# Altium project EEM_FMC_Carrier.PrjPCB (part 3 of 9)

## Sheet CLK_Distribution.SchDoc: EEM FMC Carrier
size 420 x 297 mm; EDA_Number: ARTIQ; Projet: ARTIQ/Sinara; CheckedBy: -; CompanyName: WUT ISE; DrawnBy: Paweł Kulik; Organization: WUT ISE; Address1: Warsaw University of Technology; Address2: Nowowiejska 15/19 00-665 Warsaw; Address3: pawel.kulik@pw.edu.pl; DocumentNumber: 5; SheetNumber: 8; SheetTotal: 13; ModifiedBy: -; CheckedDate: -; Title2: Clock distribution; DivGrp: ISE; Designer: Paweł Kulik; ModifiedDate: -; ProjectName: EEM_FMC_Carrier.PrjPCB
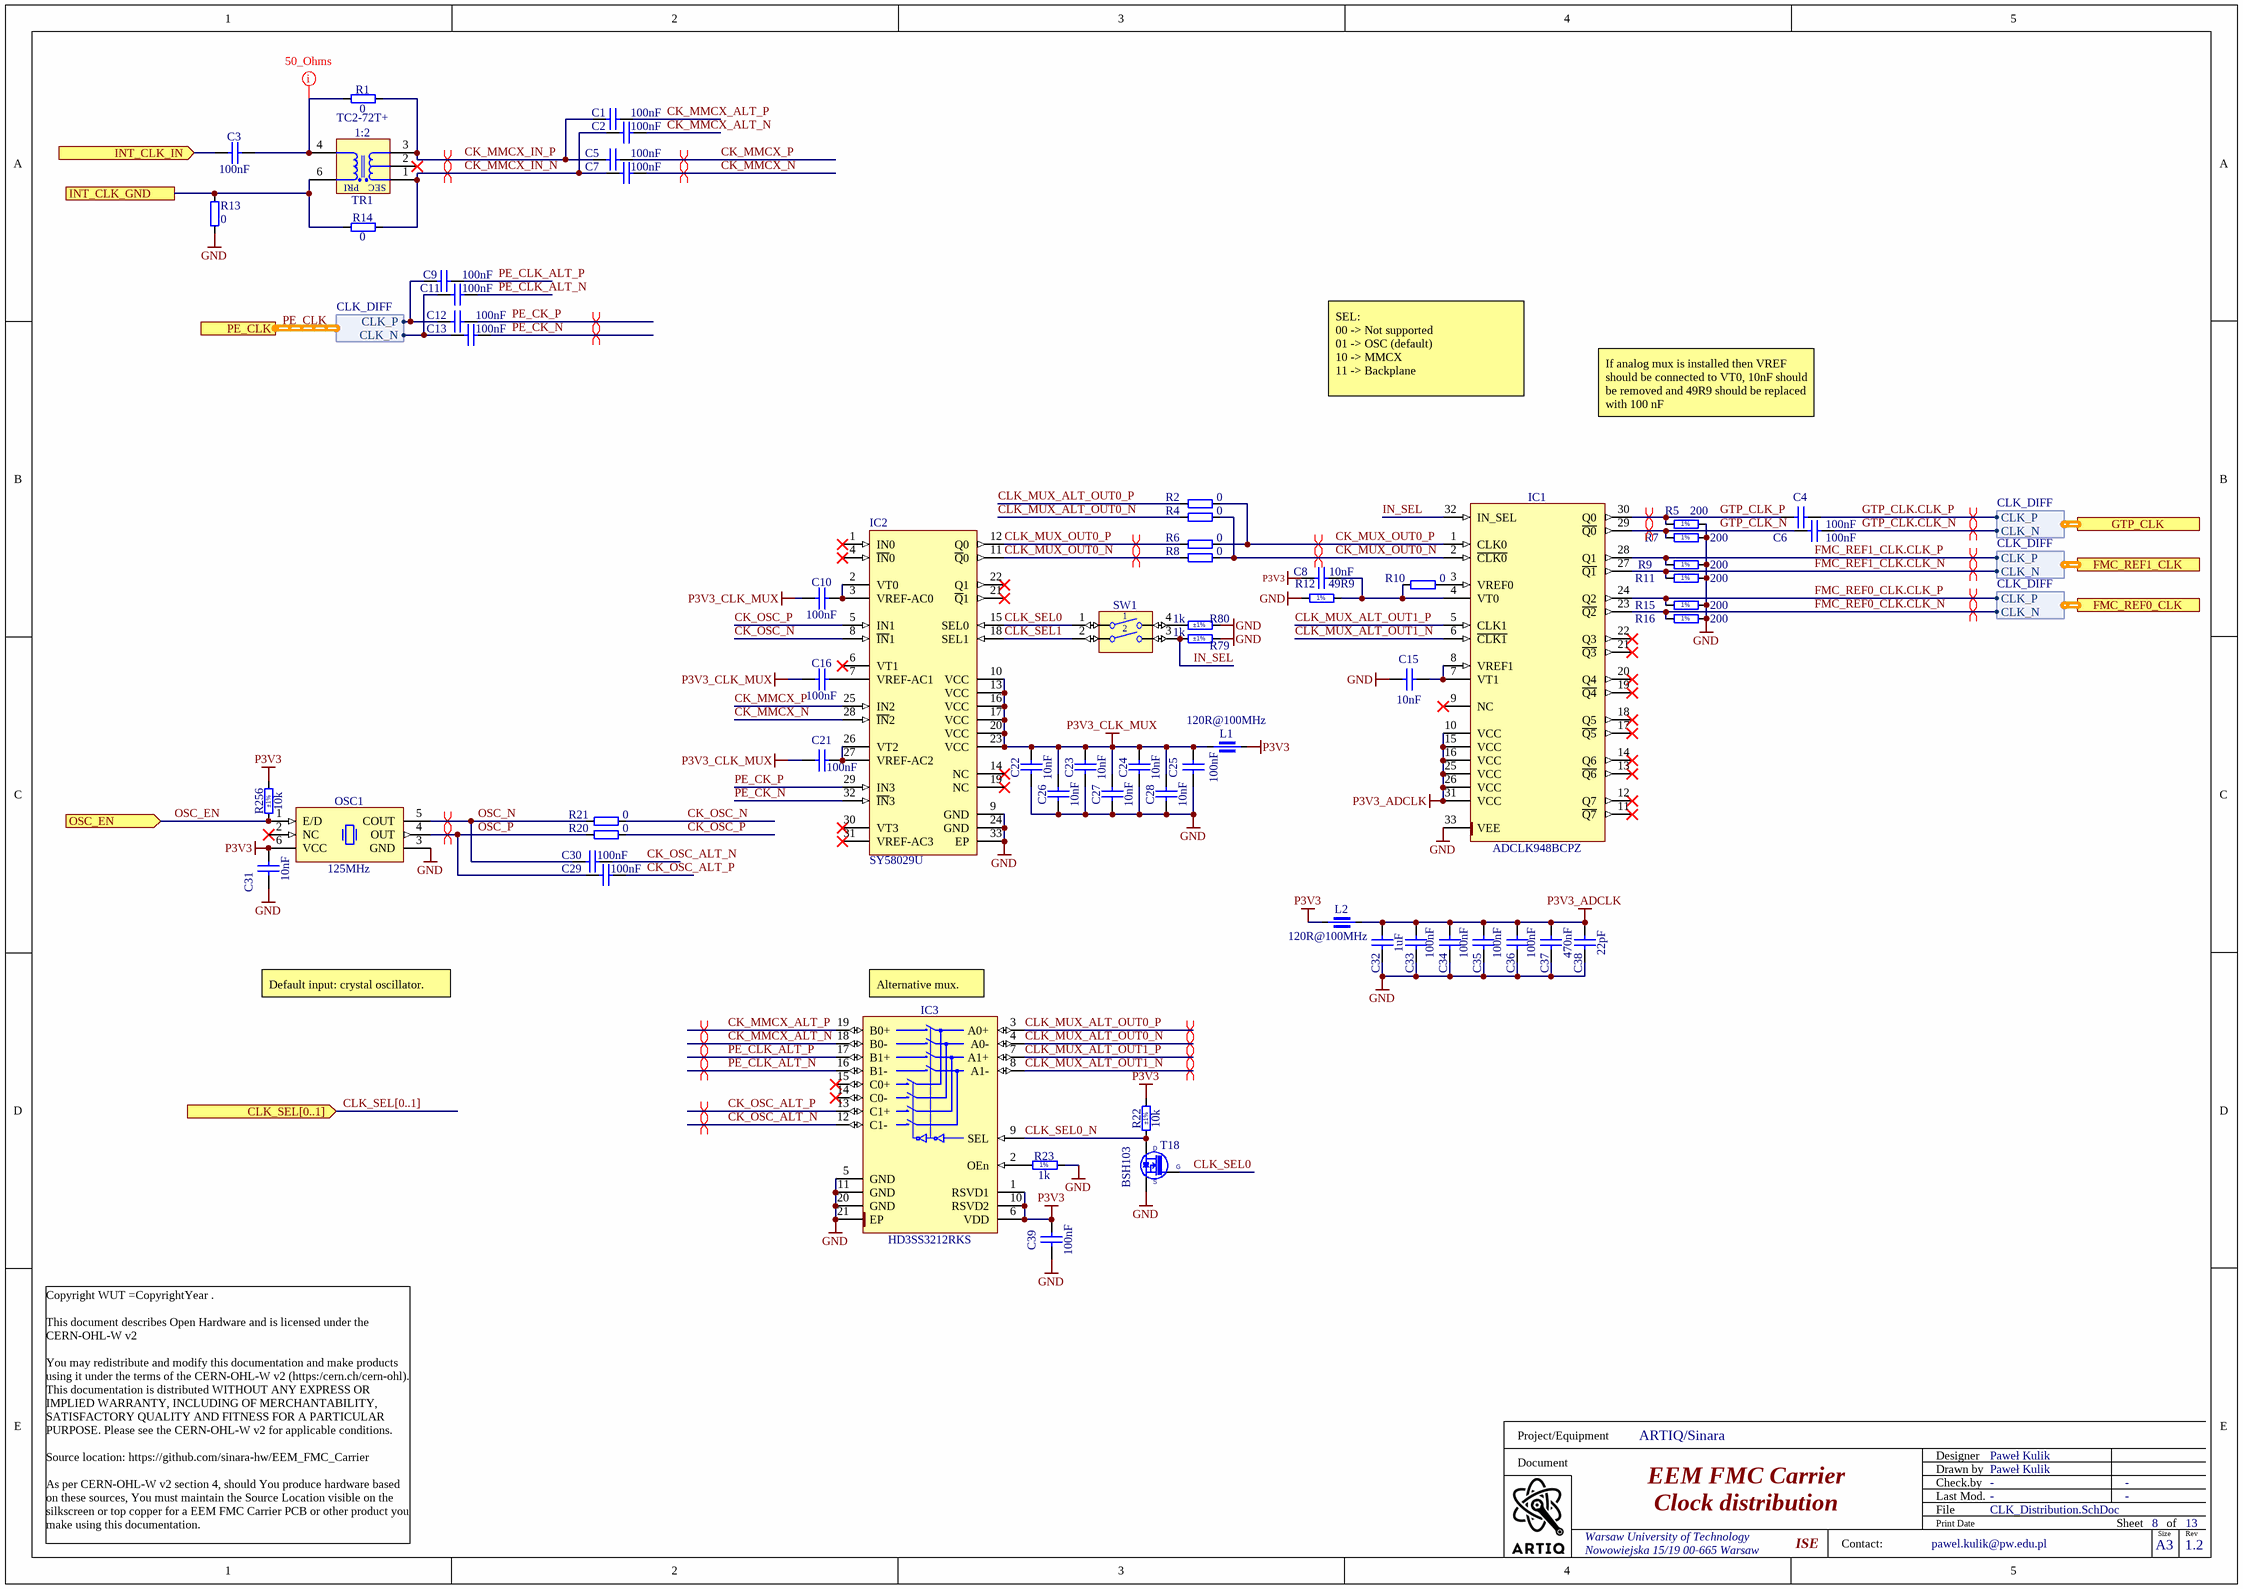
[diagram p3: CLK_Distribution.SchDoc]

### Parts
C1  100nF  [CAPC1005X55N]
C2  100nF  [CAPC1005X55N]
C3  100nF  [CAPC1005X55N]
C4  100nF  [CAPC1005X55N]
C5  100nF  [CAPC1005X55N]
C6  100nF  [CAPC1005X55N]
C7  100nF  [CAPC1005X55N]
C8  10nF  [CAPC1005X55N]
C9  100nF  [CAPC1005X55N]
C10  100nF  [CAPC1005X55N]
C11  100nF  [CAPC1005X55N]
C12  100nF  [CAPC1005X55N]
C13  100nF  [CAPC1005X55N]
C15  10nF  [CAPC1005X55N]
C16  100nF  [CAPC1005X55N]
C21  100nF  [CAPC1005X55N]
C22  10nF  [CAPC1005X55N]
C23  10nF  [CAPC1005X55N]
C24  10nF  [CAPC1005X55N]
C25  100nF  [CAPC1005X55N]
C26  10nF  [CAPC1005X55N]
C27  10nF  [CAPC1005X55N]
C28  10nF  [CAPC1005X55N]
C29  100nF  [CAPC1005X55N]
C30  100nF  [CAPC1005X55N]
C31  10nF  [CAPC1005X55N]
C32  1uF  [CAPC1005X55N]
C33  100nF  [CAPC0603X33N]
C34  100nF  [CAPC0603X33N]
C35  100nF  [CAPC0603X33N]
C36  100nF  [CAPC0603X33N]
C37  470nF  [CAPC0603X33N]
C38  22pF  [CAPC1005X55N]
C39  100nF  [CAPC1005X55N]
IC1  ADCLK948BCPZ  [QFN50P500X500X80-33N-S285]
IC2  SY58029U  [MLF-32]
IC3  HD3SS3212RKS  [TEXAS_RKS0020A]
L1  120R@100MHz  [INDC1608X65N]
L2  120R@100MHz  [INDC1608X65N]
OSC1  125MHz  [OSC_CRYSTEK_CCLD-033]
R1  0  [RESC1005X40N]
R2  0  [RESC0603X28N]
R4  0  [RESC0603X28N]
R5  200  [RESC1005X40N]
R6  0  [RESC0603X28N]
R7  200  [RESC1005X40N]
R8  0  [RESC0603X28N]
R9  200  [RESC1005X40N]
R10  0  [RESC0603X28N]
R11  200  [RESC1005X40N]
R12  49R9  [RESC1005X40N]
R13  0  [RESC1005X40N]
R14  0  [RESC1005X40N]
R15  200  [RESC1005X40N]
R16  200  [RESC1005X40N]
R20  0  [RESC1005X40N]
R21  0  [RESC1005X40N]
R22  10k  Tolerance: ±1%  [RESC1005X40N]
R23  1k  [RESC1005X40N]
R79  1k  Tolerance: ±1%  [RESC1005X40N]
R80  1k  Tolerance: ±1%  [RESC1005X40N]
R256  10k  Tolerance: ±1%  [RESC1005X40N]
SW1  Switch  [SW_TYCO_1571983-1]  (value not drawn)
T18  BSH103  [SOT95P230X110-3N]
TR1  1:2  Manufacturer Part Number: TC2-72T+  [XFMR_MINI-CIRCUITS_AT1521]

### Ports
CLK_SEL[0..1] (in), FMC_REF0_CLK (harness CLK_DIFF), FMC_REF1_CLK (harness CLK_DIFF), GTP_CLK (harness CLK_DIFF), INT_CLK_GND, INT_CLK_IN (in), OSC_EN (in), PE_CLK (harness CLK_DIFF)

### Harnesses
CLK_DIFF: CLK_P, CLK_N
CLK_DIFF: CLK_N, CLK_P

### Nets
GND: C15.1 C22.1 C23.1 C24.1 C25.1 C26.1 C27.1 C28.1 C31.1 C32.1 C33.1 C34.1 C35.1 C36.1 C37.1 C38.1 C39.1 IC1.33(VEE) IC2.9(GND) IC2.24(GND) IC2.33(EP) IC3.5(GND) IC3.11(GND) IC3.20(GND) IC3.21(EP) OSC1.3(GND) R5.2 R7.2 R9.2 R11.2 R12.1 R13.1 R15.2 R16.2 R23.2 R79.2 R80.2 T18.2(S)
P3V3: C8.1 C31.2 C39.2 IC3.1(RSVD1) IC3.6(VDD) IC3.10(RSVD2) L1.1 L2.2 OSC1.6(VCC) R22.2 R256.2
P3V3_ADCLK: C32.2 C33.2 C34.2 C35.2 C36.2 C37.2 C38.2 IC1.10(VCC) IC1.15(VCC) IC1.16(VCC) IC1.25(VCC) IC1.26(VCC) IC1.31(VCC) L2.1
P3V3_CLK_MUX: C10.1 C16.1 C21.1 C22.2 C23.2 C24.2 C25.2 C26.2 C27.2 C28.2 IC2.10(VCC) IC2.13(VCC) IC2.16(VCC) IC2.17(VCC) IC2.20(VCC) IC2.23(VCC) L1.2
CK_MMCX_ALT_N: C2.2 IC3.18(B0-)
CK_MMCX_ALT_P: C1.2 IC3.19(B0+)
CK_MMCX_IN_N: C2.1 C7.1 R14.2 TR1.1(SDOT)
CK_MMCX_IN_P: C1.1 C5.1 R1.2 TR1.3(S)
CK_MMCX_N: C7.2 IC2.28(~{IN}2)
CK_MMCX_P: C5.2 IC2.25(IN2)
CK_MUX_OUT0_N: IC1.2(~{CLK0}) R4.2 R8.2
CK_MUX_OUT0_P: IC1.1(CLK0) R2.2 R6.2
CK_OSC_ALT_N: C30.2 IC3.12(C1-)
CK_OSC_ALT_P: C29.2 IC3.13(C1+)
CK_OSC_N: IC2.8(~{IN}1) R21.2
CK_OSC_P: IC2.5(IN1) R20.2
CLK_MUX_ALT_OUT0_N: IC3.4(A0-) R4.1
CLK_MUX_ALT_OUT0_P: IC3.3(A0+) R2.1
CLK_MUX_ALT_OUT1_N: IC1.6(~{CLK1}) IC3.8(A1-)
CLK_MUX_ALT_OUT1_P: IC1.5(CLK1) IC3.7(A1+)
CLK_MUX_OUT0_N: IC2.11(~{Q}0) R8.1
CLK_MUX_OUT0_P: IC2.12(Q0) R6.1
CLK_SEL0: IC2.15(SEL0) SW1.1 T18.1(G)
CLK_SEL0_N: IC3.9(SEL) R22.1 T18.3(D)
CLK_SEL1: IC2.18(SEL1) SW1.2
FMC_REF0_CLK.CLK_N: IC1.23(~{Q2}) R16.1 ; port FMC_REF0_CLK.CLK_N
FMC_REF0_CLK.CLK_P: IC1.24(Q2) R15.1 ; port FMC_REF0_CLK.CLK_P
FMC_REF1_CLK.CLK_N: IC1.27(~{Q1}) R11.1 ; port FMC_REF1_CLK.CLK_N
FMC_REF1_CLK.CLK_P: IC1.28(Q1) R9.1 ; port FMC_REF1_CLK.CLK_P
GTP_CLK.CLK_N: C6.2 ; port GTP_CLK.CLK_N
GTP_CLK.CLK_P: C4.2 ; port GTP_CLK.CLK_P
GTP_CLK_N: C6.1 IC1.29(~{Q0}) R7.1
GTP_CLK_P: C4.1 IC1.30(Q0) R5.1
IN_SEL: IC1.32(IN_SEL) R79.1 SW1.3
OSC_EN: OSC1.1(E/D) R256.1 ; port OSC_EN
OSC_N: C30.1 OSC1.5(COUT) R21.1
OSC_P: C29.1 OSC1.4(OUT) R20.1
PE_CK_N: C13.2 IC2.32(~{IN}3)
PE_CK_P: C12.2 IC2.29(IN3)
PE_CLK.CLK_N: C11.1 C13.1 ; port PE_CLK.CLK_N
PE_CLK.CLK_P: C9.1 C12.1 ; port PE_CLK.CLK_P
PE_CLK_ALT_N: C11.2 IC3.16(B1-)
PE_CLK_ALT_P: C9.2 IC3.17(B1+)
NetC3_1: C3.1 ; port INT_CLK_IN
NetC3_2: C3.2 R1.1 TR1.4(P)
NetC8_2: C8.2 IC1.4(VT0) R10.1 R12.2
NetC10_2: C10.2 IC2.2(VT0) IC2.3(VREF-AC0)
NetC15_2: C15.2 IC1.7(VT1) IC1.8(VREF1)
NetC16_2: C16.2 IC2.7(VREF-AC1)
NetC21_2: C21.2 IC2.26(VT2) IC2.27(VREF-AC2)
NetIC1_3: IC1.3(VREF0) R10.2
NetIC3_2: IC3.2(OEn) R23.1
NetJ4_2: R13.2 R14.1 TR1.6(PDOT) ; port INT_CLK_GND
NetR80_1: R80.1 SW1.4

Not connected (* = marked no-connect by the designer): IC1 9(NC)* 11(~{Q7})* 12(Q7)* 13(~{Q6})* 14(Q6)* 17(~{Q5})* 18(Q5)* 19(~{Q4})* 20(Q4)* 21(~{Q3})* 22(Q3)*; IC2 1(IN0)* 4(~{IN}0)* 6(VT1)* 14(NC)* 19(NC)* 21(~{Q}1)* 22(Q1)* 30(VT3)* 31(VREF-AC3)*; IC3 14(C0-)* 15(C0+)*; OSC1 2(NC)*; TR1 2(NC)*

### Buses and harness runs
bus CLK_SEL[0..1] = port CLK_SEL[0..1]
harness PE_CLK = port PE_CLK

### Layout directives
differential pair; differential pair class Diff_100Ohm: CK_MMCX_ALT_N, CK_MMCX_ALT_P, CK_MMCX_IN_N, CK_MMCX_IN_P, CK_MMCX_N, CK_MMCX_P, CK_OSC_ALT_N, CK_OSC_ALT_P, OSC_N, OSC_P, PE_CK_N, PE_CK_P, PE_CLK_ALT_N, PE_CLK_ALT_P
net class 50Ohm: NetC3_2
differential pair; differential pair class LVPECL: CK_MUX_OUT0_N, CK_MUX_OUT0_P, CLK_MUX_ALT_OUT0_N, CLK_MUX_ALT_OUT0_P, CLK_MUX_ALT_OUT1_N, CLK_MUX_ALT_OUT1_P, CLK_MUX_OUT0_N, CLK_MUX_OUT0_P, FMC_REF0_CLK.CLK_N, FMC_REF0_CLK.CLK_P, FMC_REF1_CLK.CLK_N, FMC_REF1_CLK.CLK_P, GTP_CLK.CLK_N, GTP_CLK.CLK_P, GTP_CLK_N, GTP_CLK_P

### Notes on the sheet
- SEL:
  00 -> Not supported
  01 -> OSC (default)
  10 -> MMCX
  11 -> Backplane
- If analog mux is installed then VREF should be connected to VT0, 10nF should be removed and 49R9 should be replaced with 100 nF
- Default input: crystal oscillator.
- (near IC3) Alternative mux.
- Project/Equipment
- Document
- Designer
- Drawn by
- Check.by
- Copyright WUT =CopyrightYear .
  This document describes Open Hardware and is licensed under the CERN-OHL-W v2
  You may redistribute and modify this documentation and make products using it under the terms of the CERN-OHL-W v2 (https:/cern.ch/cern-ohl). This documentation is distributed WITHOUT ANY EXPRESS OR IMPLIED WARRANTY, INCLUDING OF MERCHANTABILITY, SATISFACTORY QUALITY AND FITNESS FOR A PARTICULAR PURPOSE. Please see the CERN-OHL-W v2 for applicable conditions.
  Source location: https://github.com/sinara-hw/EEM_FMC_Carrier
  As per CERN-OHL-W v2 section 4, should You produce hardware based on these sources, You must maintain the Source Location visible on the silkscreen or top copper for a EEM FMC Carrier PCB or other product you make using this documentation.
- Contact:
- File
- Last Mod.
- Print Date
- Sheet
- Size
- A3
- of
- Rev
- (in symbol R0402_1K_1%_0.0625W_100PPM) 1%
- (in symbol R0402_49R9_1%_0.0625W_100PPM) 1%
- (in symbol R0402_200R_1%_0.0625W_100PPM) 1%
- (in symbol XFMR_MINI-CIRCUITS_TC2-72T+) PRI; SEC

### Library data of the parts
C1-C7 C9-C13 C16 C21 C25 C29 C30 = CC0402_100NF_16V_10%_X5R: Non-polarised capacitor; Part Description: SMD Multilayer Chip Ceramic Capacitor; Manufacturer: GENERIC; Manufacturer1 Part Number: GRM155R61C104KA88D; Voltage: 16V; TC: X5R; Tolerance: ±10%; Part Number: CC0402_100NF_16V_10%_X5R; Component Kind: Standard; Component Type: Standard; Pin Count: 2; Value: 100nF; Status: None; Manufacturer Part Number: CC0402_100NF_16V_10%_X5R; Case: 0402; Mounted: Yes; Socket: No; SMD: Yes; Sense: No; Manufacturer1 Example: MURATA; Manufacturer1 ComponentHeight: 0.55mm; HelpURL: \\cern.ch\dfs\Applications\Altium\Datasheets\CC0402_X5R_MURATA_GRM.pdf; Author: CERN DEM JLC; CreateDate: 10.12.2013; LatestRevisionDate: 10.12.2013
C8 C15 C22-C24 C26-C28 C31 = CC0402_10NF_16V_10%_X7R: Non-polarised capacitor; Part Description: SMD Multilayer Chip Ceramic Capacitor; Manufacturer: GENERIC; Manufacturer1 Part Number: 223878715636; Voltage: 16V; TC: X7R; Tolerance: ±10%; Part Number: CC0402_10NF_16V_10%_X7R; Component Kind: Standard; Component Type: Standard; Pin Count: 2; Value: 10nF; Status: Not Recommended; Manufacturer Part Number: CC0402_10NF_16V_10%_X7R; Case: 0402; Mounted: Yes; Socket: No; SMD: Yes; Sense: No; Manufacturer1 Example: PHYCOMP; Manufacturer1 ComponentHeight: 0.55mm; HelpURL: \\cern.ch\dfs\Applications\Altium\Datasheets\CC0402_X7R_PHYCOMP.pdf; Author: CERN DEM JLC
  C8 C15 C22-C24 C26-C28: CreateDate: 2007-12-03; LatestRevisionDate: 2007-12-03
  C31: CreateDate: 03.12.2007; LatestRevisionDate: 03.12.2007
C32 = CC0402_1UF_16V_10%_X5R: Non-polarised capacitor; Part Description: SMD Multilayer Chip Ceramic Capacitor; Manufacturer: GENERIC; Manufacturer1 Part Number: C1005X5R1C105KT; Voltage: 16V; TC: X5R; Tolerance: ±10%; Part Number: CC0402_1UF_16V_10%_X5R; Component Kind: Standard; Component Type: Standard; Pin Count: 2; Value: 1uF; Status: Preferred; Manufacturer Part Number: CC0402_1UF_16V_10%_X5R; Case: 0402; Mounted: Yes; Socket: No; SMD: Yes; Sense: No; Manufacturer1 Example: TDK; Manufacturer1 ComponentHeight: 0.55mm; HelpURL: \\cern.ch\dfs\Applications\Altium\Datasheets\CC0402_X5R_TDK_C.pdf; Author: CERN DEM JLC; CreateDate: 2012-10-25; LatestRevisionDate: 2012-10-25
C33-C36 = CC0201_100NF_6.3V_10%_X5R: Non-polarised capacitor; Part Description: SMD Multilayer Chip Ceramic Capacitor; Manufacturer: GENERIC; Manufacturer1 Part Number: 02016D104KAT2A; Voltage: 6.3V; TC: X5R; Tolerance: ±10%; Part Number: CC0201_100NF_6.3V_10%_X5R; Component Kind: Standard; Component Type: Standard; Pin Count: 2; Value: 100nF; Status: Not Recommended; Manufacturer Part Number: CC0201_100NF_6.3V_10%_X5R; Case: 0201; Mounted: Yes; Socket: No; SMD: Yes; Sense: No; Manufacturer1 Example: AVX; Manufacturer1 ComponentHeight: 0.33mm; HelpURL: \\cern.ch\dfs\Applications\Altium\Datasheets\CC0201_X5R_AVX.pdf; Author: CERN DEM JLC; CreateDate: 2007-12-03; LatestRevisionDate: 2007-12-03
C37 = CC0201_470NF_4V_20%_X5R: Non-polarised capacitor; Part Description: SMD Multilayer Chip Ceramic Capacitor; Manufacturer: GENERIC; Manufacturer1 Part Number: AMK063BJ474MP-F; Voltage: 4V; TC: X5R; Tolerance: ±20%; Part Number: CC0201_470NF_4V_20%_X5R; Component Kind: Standard; Component Type: Standard; Pin Count: 2; Value: 470nF; Status: Not Recommended; Manufacturer Part Number: CC0201_470NF_4V_20%_X5R; Case: 0201; Mounted: Yes; Socket: No; SMD: Yes; Sense: No; Manufacturer1 Example: TAIYO YUDEN; Manufacturer1 ComponentHeight: 0.33mm; HelpURL: \\cern.ch\dfs\Applications\Altium\Datasheets\CC0201_X5R_TAIYO-YUDEN_STANDARD-CLASS2.pdf; Author: CERN DEM JLC; CreateDate: 27.05.2010; LatestRevisionDate: 27.05.2010
C38 = CC0402_22PF_50V_5%_C0G: Non-polarised capacitor; Part Description: SMD Multilayer Chip Ceramic Capacitor; Manufacturer: GENERIC; Manufacturer1 Part Number: C0402C220J5GACTU; Voltage: 50V; TC: C0G/NP0; Tolerance: ±5%; Part Number: CC0402_22PF_50V_5%_C0G; Component Kind: Standard; Component Type: Standard; Pin Count: 2; Value: 22pF; Status: Preferred; Manufacturer Part Number: CC0402_22PF_50V_5%_C0G; Case: 0402; Mounted: Yes; Socket: No; SMD: Yes; Sense: No; Manufacturer1 Example: KEMET; Manufacturer1 ComponentHeight: 0.55mm; HelpURL: \\cern.ch\dfs\Applications\Altium\Datasheets\CC0805_C0G_KEMET_(Commercial Grade).pdf; Author: CERN DEM JLC; CreateDate: 2007-12-03; LatestRevisionDate: 2007-12-03
C39 = CC0402_100NF_25V_10%_X7R_YUDEN_TMK105B7104KVHF: Non-polarised capacitor; Part Description: SMD Multilayer Chip Ceramic Capacitor (High Dielectric Type) for Automotive / Industrial Applications; Manufacturer: TAIYO YUDEN; Voltage: 25V; TC: X7R; Tolerance: ±10%; Part Number: CC0402_100NF_25V_10%_X7R_YUDEN_TMK105B7104KVHF; Component Kind: Standard; Component Type: Standard; Pin Count: 2; Value: 100nF; Status: Not Recommended; Manufacturer Part Number: TMK105B7104KVHF; Case: 0402; Mounted: Yes; Socket: No; SMD: Yes; Sense: No; HelpURL: \\cern.ch\dfs\Applications\Altium\Datasheets\CC0402_TAIYO-YUDEN_TMK105B7104KVHF.pdf; Author: CERN DEM JLC; CreateDate: 10-May-17; LatestRevisionDate: 10-May-17; ComponentHeight: 0.55mm
IC1 = ADCLK948BCPZ: Two Selectable Inputs, 8 LVPECL Outputs, SiGe Clock Fanout Buffer; Manufacturer: ANALOG DEVICES; PressFit: No; Bonding: No; Part Number: ADCLK948BCPZ; Component Kind: Standard; Component Type: Standard; Device: ADCLK948BCPZ; PackageDescription: QFN, 0.50mm Pitch, Square; 32 Pin, 5.00mm L X 5.00mm W X 0.80mm H body (w/Thermal Tab 2.85 X 2.85mm), IPC Medium Density; Part Description: Two Selectable Inputs, 8 LVPECL Outputs, SiGe Clock Fanout Buffer; Manufacturer Part Number: ADCLK948BCPZ; Pin Count: 33; Case: QFN32; Mounted: Yes; Socket: No; SMD: Yes; Sense: No; ComponentHeight: 0.8mm; Author: CERN DEM MR; HelpURL: \\cern.ch\dfs\Applications\Altium\Datasheets\ADCLK948BCPZ.pdf; CreateDate: 2016-11-30; LatestRevisionDate: 2016-11-30
IC2 = SY58029U: ULTRA PRECISION DIFFERENTIAL LVPECL 4:1 MUX with 1:2 FANOUT and INTERNAL TERMINATION; Manufacturer: Microchip; Manufacturer Part Number: SY58029U; Device: SY58029U
IC3 = HD3SS3212RKS: Two-Channel Differential 2:1/1:2 USB3.1 Mux/Demux; Manufacturer: TEXAS INSTRUMENTS; PressFit: No; Bonding: No; Part Number: HD3SS3212RKS; Component Kind: Standard; Component Type: Standard; Device: HD3SS3212RKS; PackageDescription: QFN, TEXAS Case Style RKS, 0.50mm Pitch, Rect.; 20 Pin, 2.50mm L X 4.50mm W X 1.00mm H body (w/Thermal Tab 1.1mm X 3.1mm); Part Description: Two-Channel Differential 2:1/1:2 USB3.1 Mux/Demux; Manufacturer Part Number: HD3SS3212RKS; Pin Count: 21; Case: TQFN20; Mounted: Yes; Socket: No; SMD: Yes; Sense: No; ComponentHeight: 1mm; Author: CERN DEM BC; HelpURL: \\cern.ch\dfs\Applications\Altium\Datasheets\HD3SS3212RKS.pdf; CreateDate: 2019-11-06; LatestRevisionDate: 2019-11-06
L1 L2 = IND0603_MURATA_BLM18SG121TN1D: Part Description: SMD EMIFIL Suppression Chip Ferrite Bead; Manufacturer: MURATA; Power: 3A; Resistance: 0.025R; Tolerance: ±25%; Part Number: IND0603_MURATA_BLM18SG121TN1D; Component Kind: Standard; Component Type: Standard; Pin Count: 2; Value: 120R@100MHz; Status: None; Manufacturer Part Number: BLM18SG121TN1D; Case: 0603; Mounted: Yes; Socket: No; SMD: Yes; Sense: No; ComponentHeight: 0.65mm; HelpURL: \\cern.ch\dfs\Applications\Altium\Datasheets\IND0603_MURATA_BLM18S.pdf; Author: CERN DEM JLC; CreateDate: 23.07.2014; LatestRevisionDate: 25.10.2018
OSC1 = OSC_CRYSTEK_CCLD-033: 3.3V, ± 50ppm, 0°C to +70°C, Surface Mount LVDS Clock Oscillator (CCLD-033 Series); Part Number: OSC_125MHZ_CRYSTEK_CCLD-033-50-125.000; Manufacturer: CRYSTEK CRYSTAL; Manufacturer Part Number: CCLD-033-50-125.000; PressFit: No; Bonding: No; Component Kind: Standard; Component Type: Standard; PackageDescription: Oscillator, Side Concave, 2.54mm Pitch, 6 Pins, 5.00mm L X 7.00mm W X 1.80mm H, CCLD-033 Series; Value: 125MHz; Part Description: 3.3V, ± 50ppm, 0°C to +70°C, Surface Mount LVDS Clock Oscillator (CCLD-033 Series); Pin Count: 6; Mounted: Yes; Socket: No; SMD: Yes; Sense: No; ComponentHeight: 1.8mm; HelpURL: \\cern.ch\dfs\Applications\Altium\Datasheets\OSC_CRYSTEK_CCLD-033.pdf; Author: CERN DEM JLC; CreateDate: 23.02.2017; LatestRevisionDate: 23.02.2017
R1 R13 R14 R20 R21 = R0402_0R_JUMPER: Resistor; Part Description: 1A (0.05R Max DC Resistance) Zero Ohm Jumper; Manufacturer: GENERIC; Manufacturer1 Part Number: 232270591001L; PressFit: No; Part Number: R0402_0R_JUMPER; Component Kind: Standard; Component Type: Standard; Pin Count: 2; Value: 0; Status: Not Recommended; Manufacturer Part Number: R0402_0R_JUMPER; Case: 0402; Mounted: Yes; Sense: No; Socket: No; SMD: Yes; Manufacturer1 Example: YAGEO PHYCOMP; Manufacturer1 ComponentHeight: 0.4mm; HelpURL: \\cern.ch\dfs\Applications\Altium\Datasheets\R0402_Phycomp_RC0402.pdf; Author: CERN DEM JLC; CreateDate: 03.12.2007; LatestRevisionDate: 17.10.2012
R2 R4 R6 R8 R10 = R0201_0R_JUMPER: Resistor; Part Description: 1A (0.05R Max DC Resistance) Zero Ohm Jumper; Manufacturer: GENERIC; Manufacturer1 Part Number: CRCW02010000Z0ED; PressFit: No; Part Number: R0201_0R_JUMPER; Component Kind: Standard; Component Type: Standard; Pin Count: 2; Value: 0; Status: Not Recommended; Manufacturer Part Number: R0201_0R_JUMPER; Case: 0201; Mounted: Yes; Sense: No; Socket: No; SMD: Yes; Manufacturer1 Example: VISHAY; Manufacturer1 ComponentHeight: 0.27mm; HelpURL: \\cern.ch\dfs\Applications\Altium\Datasheets\R0201_VISHAY_CRCW e3.pdf; Author: CERN DEM JLC; CreateDate: 2014-11-19; LatestRevisionDate: 2015-01-08
R5 R7 R9 R11 R15 R16 = R0402_200R_1%_0.0625W_100PPM: Resistor - 1%; Part Description: General Purpose Thick Film Chip Resistor; Manufacturer: GENERIC; Manufacturer1 Part Number: 232270672001L; TC: ±100ppm/°C; PressFit: No; Part Number: R0402_200R_1%_0.0625W_100PPM; Component Kind: Standard; Component Type: Standard; Pin Count: 2; Value: 200; Status: Not Recommended; Power: 0.0625W; Tolerance: ±1%; Manufacturer Part Number: R0402_200R_1%_0.0625W_100PPM; Case: 0402; Mounted: Yes; Sense: No; Socket: No; SMD: Yes; Manufacturer1 Example: YAGEO PHYCOMP; Manufacturer1 ComponentHeight: 0.4mm; HelpURL: \\cern.ch\dfs\Applications\Altium\Datasheets\R0402_Phycomp_RC0402.pdf; Author: CERN DEM JLC; CreateDate: 03.12.2007; LatestRevisionDate: 17.10.2012
R12 = R0402_49R9_1%_0.0625W_100PPM: Resistor - 1%; Part Description: General Purpose Thick Film Chip Resistor; Manufacturer: GENERIC; Manufacturer1 Part Number: 232270674999L or RC0402FR-0749R9L; TC: ±100ppm/°C; PressFit: No; Part Number: R0402_49R9_1%_0.0625W_100PPM; Component Kind: Standard; Component Type: Standard; Pin Count: 2; Value: 49R9; Status: Not Recommended; Power: 0.0625W; Tolerance: ±1%; Manufacturer Part Number: R0402_49R9_1%_0.0625W_100PPM; Case: 0402; Mounted: Yes; Sense: No; Socket: No; SMD: Yes; Manufacturer1 Example: YAGEO PHYCOMP; Manufacturer1 ComponentHeight: 0.4mm; HelpURL: \\cern.ch\dfs\Applications\Altium\Datasheets\R0402_Phycomp_RC0402.pdf; Author: CERN DEM JLC; CreateDate: 24.10.2012; LatestRevisionDate: 24.10.2012
R22 R256 = R0402_10K_1%_0.0625W_100PPM: Resistor - 1%; Part Description: General Purpose Thick Film Chip Resistor; Manufacturer: GENERIC; Manufacturer1 Part Number: 232270671003L; TC: ±100ppm/°C; PressFit: No; Part Number: R0402_10K_1%_0.0625W_100PPM; Component Kind: Standard; Component Type: Standard; Pin Count: 2; Value: 10k; Status: Not Recommended; Power: 0.0625W; Manufacturer Part Number: R0402_10K_1%_0.0625W_100PPM; Case: 0402; Mounted: Yes; Sense: No; Socket: No; SMD: Yes; Manufacturer1 Example: YAGEO PHYCOMP; Manufacturer1 ComponentHeight: 0.4mm; HelpURL: \\cern.ch\dfs\Applications\Altium\Datasheets\R0402_Phycomp_RC0402.pdf; Author: CERN DEM JLC; CreateDate: 2007-12-03; LatestRevisionDate: 2012-10-17
R23 R79 R80 = R0402_1K_1%_0.0625W_100PPM: Resistor - 1%; Part Description: General Purpose Thick Film Chip Resistor; Manufacturer: GENERIC; Manufacturer1 Part Number: 232270671002L; TC: ±100ppm/°C; PressFit: No; Part Number: R0402_1K_1%_0.0625W_100PPM; Component Kind: Standard; Component Type: Standard; Pin Count: 2; Value: 1k; Status: Not Recommended; Power: 0.0625W; Manufacturer Part Number: R0402_1K_1%_0.0625W_100PPM; Case: 0402; Mounted: Yes; Sense: No; Socket: No; SMD: Yes; Manufacturer1 Example: YAGEO PHYCOMP; Manufacturer1 ComponentHeight: 0.4mm; HelpURL: \\cern.ch\dfs\Applications\Altium\Datasheets\R0402_Phycomp_RC0402.pdf; Author: CERN DEM JLC
  R23: Tolerance: ±1%; CreateDate: 2007-12-03; LatestRevisionDate: 2012-10-17
  R79 R80: CreateDate: 03.12.2007; LatestRevisionDate: 17.10.2012
SW1 = SW_TYCO_1571983-1: 2 Ways SPST DIP Switch; Part Description: 2 Way SPST SMD DIP Switch, Latched, Contact Rating 0.025A 24VDC; Manufacturer: TYCO; Manufacturer Part Number: 1571983-1 or GDH02S04; PressFit: No; Part Number: SW_TYCO_1571983-1; Component Kind: Standard; Component Type: Standard; Pin Count: 4; PackageDescription: Pitch 1.27mm,  Body3.66x6.2mm, 2 Ways SPST Surface-Mount DIP Switch, TYCO GDH Series; Family: Switch; Mounted: Yes; Socket: No; SMD: Yes; Sense: No; Status: None; ComponentHeight: 2.31mm; HelpURL: \\cern.ch\dfs\Applications\Altium\Datasheets\SW_TYCO_1571983-1.pdf; Author: CERN DEM JLC; CreateDate: 08.01.2009; LatestRevisionDate: 08.01.2009
T18 = BSH103: N-CHANNEL MOSFET WITH DIODE; Part Description: 30V 850mA N-Channel Enhancement Mode Field-Effect Transistor; Manufacturer: NEXPERIA; PressFit: No; Bonding: No; Part Number: BSH103; Component Kind: Standard; Component Type: Standard; Device: BSH103; PackageDescription: SOT23, 0.95mm Pitch; 3 Pin, 1.30mm W X 2.90mm L X 1.10mm H body, IPC Medium Density; Manufacturer Part Number: BSH103; Pin Count: 3; Case: SOT23-3; Mounted: Yes; Socket: No; SMD: Yes; Sense: No; ComponentHeight: 1.1mm; HelpURL: \\cern.ch\dfs\Applications\Altium\Datasheets\BSH103.pdf; Author: CERN DEM JLC; CreateDate: 16.03.2010; LatestRevisionDate: 20.06.2017
TR1 = XFMR_MINI-CIRCUITS_TC2-72T+: 50 Ohms 10 to 700 MHzz RF Transformer; Part Description: 50 Ohms 10 to 700MHz RF Transformer; Manufacturer: MINI-CIRCUITS; HelpURL: \\cern.ch\dfs\Applications\Altium\Datasheets\XFMR_MINI-CIRCUITS_TC2-1TX+.pdf; Part Number: XFMR_MINI-CIRCUITS_TC2-72T+; Component Kind: Standard; Component Type: Standard; Pin Count: 5; Value: 1:2; Status: None; Mounted: Yes; Socket: No; Sense: No; SMD: Yes; ComponentHeight: 4.06mm; Author: GK; CreateDate: 18.10.2019; LatestRevisionDate: 18.10.2019

## Sheet FPGA_FMC.SchDoc: EEM FMC Carrier
size 420 x 297 mm; EDA_Number: ARTIQ; Projet: ARTIQ/Sinara; CheckedBy: -; CompanyName: WUT ISE; DrawnBy: Paweł Kulik; Organization: WUT ISE; Address1: Warsaw University of Technology; Address2: Nowowiejska 15/19 00-665 Warsaw; Address3: pawel.kulik@pw.edu.pl; DocumentNumber: 3; SheetNumber: 3; SheetTotal: 13; ModifiedBy: -; CheckedDate: -; Title2: FPGA FMC; DivGrp: ISE; Designer: Paweł Kulik; ModifiedDate: -; ProjectName: EEM_FMC_Carrier.PrjPCB
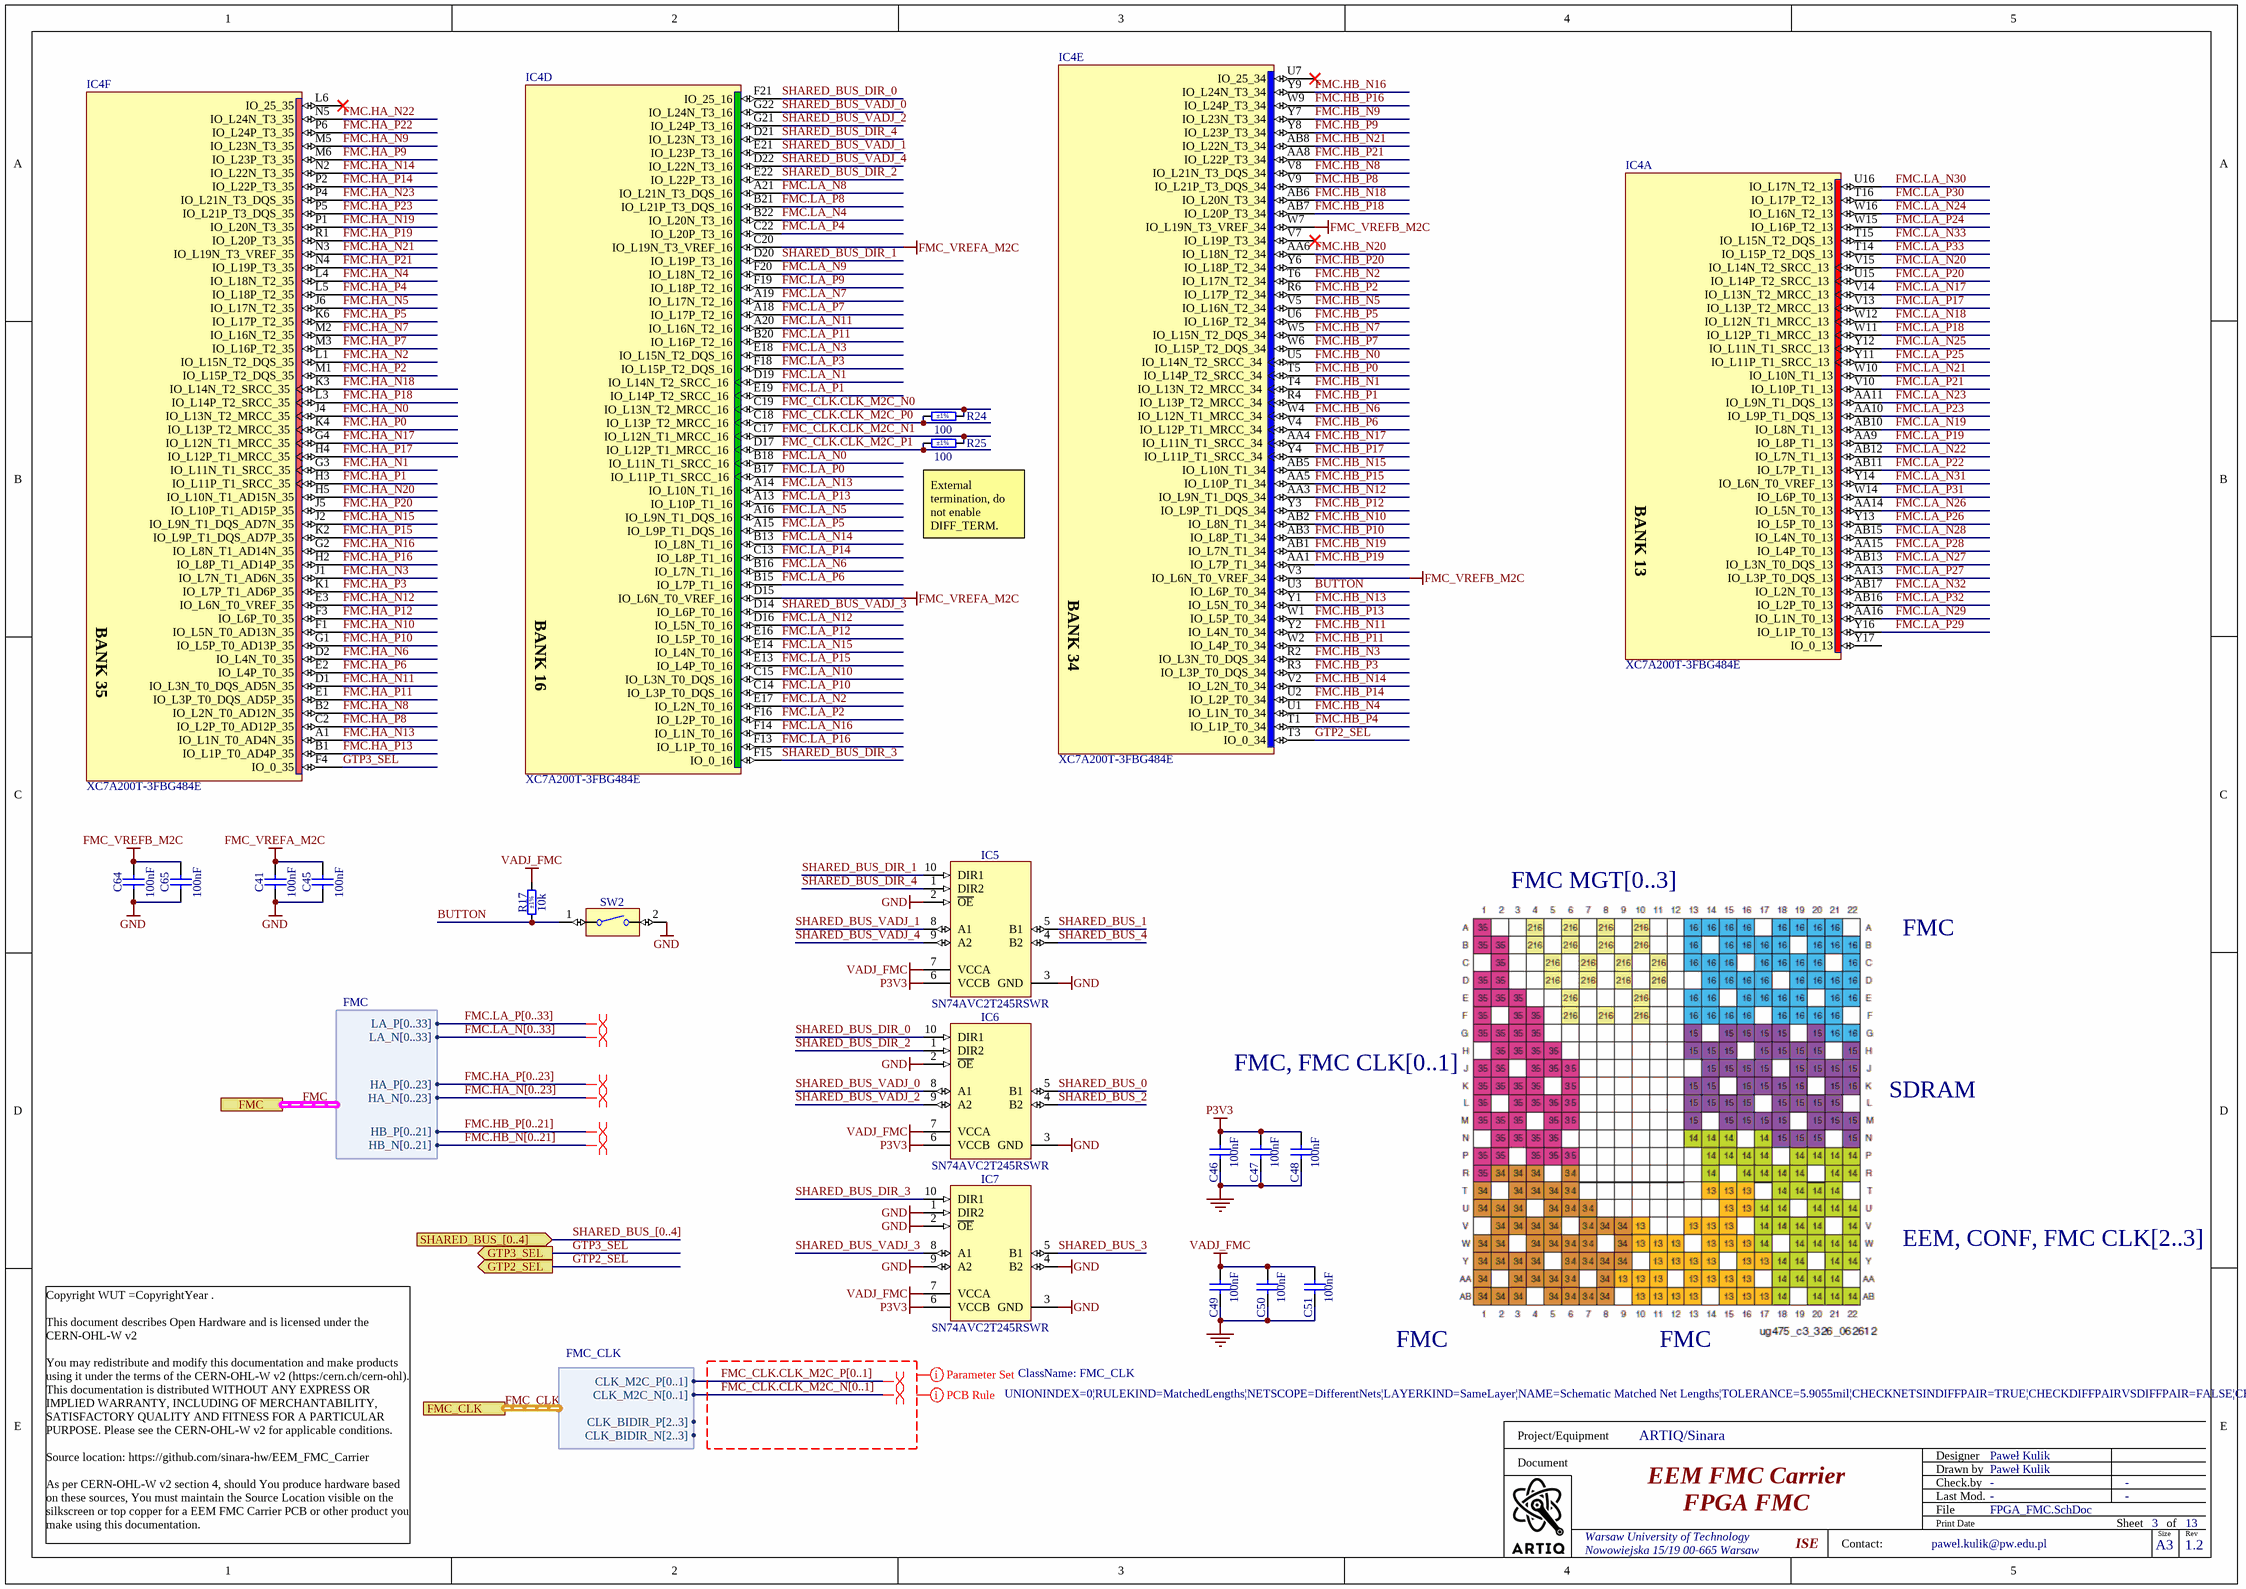
[diagram p4: FPGA_FMC.SchDoc]

### Parts
(Parts that share a designator on the sheet are numbered #1, #2 ... from top to bottom, then left to right.)
C41  100nF  [CAPC0603X33N]
C45  100nF  [CAPC0603X33N]
C46  100nF  [CAPC0603X33N]
C47  100nF  [CAPC0603X33N]
C48  100nF  [CAPC0603X33N]
C49  100nF  [CAPC0603X33N]
C50  100nF  [CAPC0603X33N]
C51  100nF  [CAPC0603X33N]
C64#1  100nF  [CAPC0603X33N]
C65#1  100nF  [CAPC0603X33N]
IC4  XC7A200T-3FBG484E  [BGA484C100P22X22_2300X2300X254]  (parts A,D,E,F of 10)
IC5  SN74AVC2T245RSWR  [QFN40P140X180X55-10N]
IC6  SN74AVC2T245RSWR  [QFN40P140X180X55-10N]
IC7  SN74AVC2T245RSWR  [QFN40P140X180X55-10N]
R17  10k  Tolerance: ±1%  [RESC1005X40N]
R24  100  Tolerance: ±1%  [RESC0603X28N]
R25  100  Tolerance: ±1%  [RESC0603X28N]
SW2  Switch  [SW_OMRON_B3U-3000PM]  (value not drawn)

### Ports
FMC (harness FMC), FMC_CLK (harness FMC_CLK), GTP2_SEL (out), GTP3_SEL (out), SHARED_BUS_[0..4] (in)

### Harnesses
FMC: LA_P[0..33], LA_N[0..33], HA_P[0..23], HA_N[0..23], HB_P[0..21], HB_N[0..21]
FMC_CLK: CLK_M2C_P[0..1], CLK_M2C_N[0..1], CLK_BIDIR_P[2..3], CLK_BIDIR_N[2..3]

### Nets
FMC_VREFA_M2C: C41.2 C45.2 IC4.C20(IO_L19N_T3_VREF_16) IC4.D15(IO_L6N_T0_VREF_16)
FMC_VREFB_M2C: C64#1.2 C65#1.2 IC4.V3(IO_L6N_T0_VREF_34) IC4.W7(IO_L19N_T3_VREF_34)
GND: C41.1 C45.1 C46.1 C47.1 C48.1 C49.1 C50.1 C51.1 C64#1.1 C65#1.1 IC5.2(~{OE}) IC5.3(GND) IC6.2(~{OE}) IC6.3(GND) IC7.1(DIR2) IC7.2(~{OE}) IC7.3(GND) IC7.4(B2) IC7.9(A2) SW2.2
P3V3: C46.2 C47.2 C48.2 IC5.6(VCCB) IC6.6(VCCB) IC7.6(VCCB)
VADJ_FMC: C49.2 C50.2 C51.2 IC5.7(VCCA) IC6.7(VCCA) IC7.7(VCCA) R17.2
BUTTON: IC4.U3(IO_L6P_T0_34) R17.1 SW2.1
FMC.HA_N0: IC4.J4(IO_L13N_T2_MRCC_35)
FMC.HA_N1: IC4.G3(IO_L11N_T1_SRCC_35)
FMC.HA_N2: IC4.L1(IO_L15N_T2_DQS_35)
FMC.HA_N3: IC4.J1(IO_L7N_T1_AD6N_35)
FMC.HA_N4: IC4.L4(IO_L18N_T2_35)
FMC.HA_N5: IC4.J6(IO_L17N_T2_35)
FMC.HA_N6: IC4.D2(IO_L4N_T0_35)
FMC.HA_N7: IC4.M2(IO_L16N_T2_35)
FMC.HA_N8: IC4.B2(IO_L2N_T0_AD12N_35)
FMC.HA_N9: IC4.M5(IO_L23N_T3_35)
FMC.HA_N10: IC4.F1(IO_L5N_T0_AD13N_35)
FMC.HA_N11: IC4.D1(IO_L3N_T0_DQS_AD5N_35)
FMC.HA_N12: IC4.E3(IO_L6N_T0_VREF_35)
FMC.HA_N13: IC4.A1(IO_L1N_T0_AD4N_35)
FMC.HA_N14: IC4.N2(IO_L22N_T3_35)
FMC.HA_N15: IC4.J2(IO_L9N_T1_DQS_AD7N_35)
FMC.HA_N16: IC4.G2(IO_L8N_T1_AD14N_35)
FMC.HA_N17: IC4.G4(IO_L12N_T1_MRCC_35)
FMC.HA_N18: IC4.K3(IO_L14N_T2_SRCC_35)
FMC.HA_N19: IC4.P1(IO_L20N_T3_35)
FMC.HA_N20: IC4.H5(IO_L10N_T1_AD15N_35)
FMC.HA_N21: IC4.N3(IO_L19N_T3_VREF_35)
FMC.HA_N22: IC4.N5(IO_L24N_T3_35)
FMC.HA_N23: IC4.P4(IO_L21N_T3_DQS_35)
FMC.HA_P0: IC4.K4(IO_L13P_T2_MRCC_35)
FMC.HA_P1: IC4.H3(IO_L11P_T1_SRCC_35)
FMC.HA_P2: IC4.M1(IO_L15P_T2_DQS_35)
FMC.HA_P3: IC4.K1(IO_L7P_T1_AD6P_35)
FMC.HA_P4: IC4.L5(IO_L18P_T2_35)
FMC.HA_P5: IC4.K6(IO_L17P_T2_35)
FMC.HA_P6: IC4.E2(IO_L4P_T0_35)
FMC.HA_P7: IC4.M3(IO_L16P_T2_35)
FMC.HA_P8: IC4.C2(IO_L2P_T0_AD12P_35)
FMC.HA_P9: IC4.M6(IO_L23P_T3_35)
FMC.HA_P10: IC4.G1(IO_L5P_T0_AD13P_35)
FMC.HA_P11: IC4.E1(IO_L3P_T0_DQS_AD5P_35)
FMC.HA_P12: IC4.F3(IO_L6P_T0_35)
FMC.HA_P13: IC4.B1(IO_L1P_T0_AD4P_35)
FMC.HA_P14: IC4.P2(IO_L22P_T3_35)
FMC.HA_P15: IC4.K2(IO_L9P_T1_DQS_AD7P_35)
FMC.HA_P16: IC4.H2(IO_L8P_T1_AD14P_35)
FMC.HA_P17: IC4.H4(IO_L12P_T1_MRCC_35)
FMC.HA_P18: IC4.L3(IO_L14P_T2_SRCC_35)
FMC.HA_P19: IC4.R1(IO_L20P_T3_35)
FMC.HA_P20: IC4.J5(IO_L10P_T1_AD15P_35)
FMC.HA_P21: IC4.N4(IO_L19P_T3_35)
FMC.HA_P22: IC4.P6(IO_L24P_T3_35)
FMC.HA_P23: IC4.P5(IO_L21P_T3_DQS_35)
FMC.HB_N0: IC4.U5(IO_L14N_T2_SRCC_34)
FMC.HB_N1: IC4.T4(IO_L13N_T2_MRCC_34)
FMC.HB_N2: IC4.T6(IO_L17N_T2_34)
FMC.HB_N3: IC4.R2(IO_L3N_T0_DQS_34)
FMC.HB_N4: IC4.U1(IO_L1N_T0_34)
FMC.HB_N5: IC4.V5(IO_L16N_T2_34)
FMC.HB_N6: IC4.W4(IO_L12N_T1_MRCC_34)
FMC.HB_N7: IC4.W5(IO_L15N_T2_DQS_34)
FMC.HB_N8: IC4.V8(IO_L21N_T3_DQS_34)
FMC.HB_N9: IC4.Y7(IO_L23N_T3_34)
FMC.HB_N10: IC4.AB2(IO_L8N_T1_34)
FMC.HB_N11: IC4.Y2(IO_L4N_T0_34)
FMC.HB_N12: IC4.AA3(IO_L9N_T1_DQS_34)
FMC.HB_N13: IC4.Y1(IO_L5N_T0_34)
FMC.HB_N14: IC4.V2(IO_L2N_T0_34)
FMC.HB_N15: IC4.AB5(IO_L10N_T1_34)
FMC.HB_N16: IC4.Y9(IO_L24N_T3_34)
FMC.HB_N17: IC4.AA4(IO_L11N_T1_SRCC_34)
FMC.HB_N18: IC4.AB6(IO_L20N_T3_34)
FMC.HB_N19: IC4.AB1(IO_L7N_T1_34)
FMC.HB_N20: IC4.AA6(IO_L18N_T2_34)
FMC.HB_N21: IC4.AB8(IO_L22N_T3_34)
FMC.HB_P0: IC4.T5(IO_L14P_T2_SRCC_34)
FMC.HB_P1: IC4.R4(IO_L13P_T2_MRCC_34)
FMC.HB_P2: IC4.R6(IO_L17P_T2_34)
FMC.HB_P3: IC4.R3(IO_L3P_T0_DQS_34)
FMC.HB_P4: IC4.T1(IO_L1P_T0_34)
FMC.HB_P5: IC4.U6(IO_L16P_T2_34)
FMC.HB_P6: IC4.V4(IO_L12P_T1_MRCC_34)
FMC.HB_P7: IC4.W6(IO_L15P_T2_DQS_34)
FMC.HB_P8: IC4.V9(IO_L21P_T3_DQS_34)
FMC.HB_P9: IC4.Y8(IO_L23P_T3_34)
FMC.HB_P10: IC4.AB3(IO_L8P_T1_34)
FMC.HB_P11: IC4.W2(IO_L4P_T0_34)
FMC.HB_P12: IC4.Y3(IO_L9P_T1_DQS_34)
FMC.HB_P13: IC4.W1(IO_L5P_T0_34)
FMC.HB_P14: IC4.U2(IO_L2P_T0_34)
FMC.HB_P15: IC4.AA5(IO_L10P_T1_34)
FMC.HB_P16: IC4.W9(IO_L24P_T3_34)
FMC.HB_P17: IC4.Y4(IO_L11P_T1_SRCC_34)
FMC.HB_P18: IC4.AB7(IO_L20P_T3_34)
FMC.HB_P19: IC4.AA1(IO_L7P_T1_34)
FMC.HB_P20: IC4.Y6(IO_L18P_T2_34)
FMC.HB_P21: IC4.AA8(IO_L22P_T3_34)
FMC.LA_N0: IC4.B18(IO_L11N_T1_SRCC_16)
FMC.LA_N1: IC4.D19(IO_L14N_T2_SRCC_16)
FMC.LA_N2: IC4.E17(IO_L2N_T0_16)
FMC.LA_N3: IC4.E18(IO_L15N_T2_DQS_16)
FMC.LA_N4: IC4.B22(IO_L20N_T3_16)
FMC.LA_N5: IC4.A16(IO_L9N_T1_DQS_16)
FMC.LA_N6: IC4.B16(IO_L7N_T1_16)
FMC.LA_N7: IC4.A19(IO_L17N_T2_16)
FMC.LA_N8: IC4.A21(IO_L21N_T3_DQS_16)
FMC.LA_N9: IC4.F20(IO_L18N_T2_16)
FMC.LA_N10: IC4.C15(IO_L3N_T0_DQS_16)
FMC.LA_N11: IC4.A20(IO_L16N_T2_16)
FMC.LA_N12: IC4.D16(IO_L5N_T0_16)
FMC.LA_N13: IC4.A14(IO_L10N_T1_16)
FMC.LA_N14: IC4.B13(IO_L8N_T1_16)
FMC.LA_N15: IC4.E14(IO_L4N_T0_16)
FMC.LA_N16: IC4.F14(IO_L1N_T0_16)
FMC.LA_N17: IC4.V14(IO_L13N_T2_MRCC_13)
FMC.LA_N18: IC4.W12(IO_L12N_T1_MRCC_13)
FMC.LA_N19: IC4.AB10(IO_L8N_T1_13)
FMC.LA_N20: IC4.V15(IO_L14N_T2_SRCC_13)
FMC.LA_N21: IC4.W10(IO_L10N_T1_13)
FMC.LA_N22: IC4.AB12(IO_L7N_T1_13)
FMC.LA_N23: IC4.AA11(IO_L9N_T1_DQS_13)
FMC.LA_N24: IC4.W16(IO_L16N_T2_13)
FMC.LA_N25: IC4.Y12(IO_L11N_T1_SRCC_13)
FMC.LA_N26: IC4.AA14(IO_L5N_T0_13)
FMC.LA_N27: IC4.AB13(IO_L3N_T0_DQS_13)
FMC.LA_N28: IC4.AB15(IO_L4N_T0_13)
FMC.LA_N29: IC4.AA16(IO_L1N_T0_13)
FMC.LA_N30: IC4.U16(IO_L17N_T2_13)
FMC.LA_N31: IC4.Y14(IO_L6N_T0_VREF_13)
FMC.LA_N32: IC4.AB17(IO_L2N_T0_13)
FMC.LA_N33: IC4.T15(IO_L15N_T2_DQS_13)
FMC.LA_P0: IC4.B17(IO_L11P_T1_SRCC_16)
FMC.LA_P1: IC4.E19(IO_L14P_T2_SRCC_16)
FMC.LA_P2: IC4.F16(IO_L2P_T0_16)
FMC.LA_P3: IC4.F18(IO_L15P_T2_DQS_16)
FMC.LA_P4: IC4.C22(IO_L20P_T3_16)
FMC.LA_P5: IC4.A15(IO_L9P_T1_DQS_16)
FMC.LA_P6: IC4.B15(IO_L7P_T1_16)
FMC.LA_P7: IC4.A18(IO_L17P_T2_16)
FMC.LA_P8: IC4.B21(IO_L21P_T3_DQS_16)
FMC.LA_P9: IC4.F19(IO_L18P_T2_16)
FMC.LA_P10: IC4.C14(IO_L3P_T0_DQS_16)
FMC.LA_P11: IC4.B20(IO_L16P_T2_16)
FMC.LA_P12: IC4.E16(IO_L5P_T0_16)
FMC.LA_P13: IC4.A13(IO_L10P_T1_16)
FMC.LA_P14: IC4.C13(IO_L8P_T1_16)
FMC.LA_P15: IC4.E13(IO_L4P_T0_16)
FMC.LA_P16: IC4.F13(IO_L1P_T0_16)
FMC.LA_P17: IC4.V13(IO_L13P_T2_MRCC_13)
FMC.LA_P18: IC4.W11(IO_L12P_T1_MRCC_13)
FMC.LA_P19: IC4.AA9(IO_L8P_T1_13)
FMC.LA_P20: IC4.U15(IO_L14P_T2_SRCC_13)
FMC.LA_P21: IC4.V10(IO_L10P_T1_13)
FMC.LA_P22: IC4.AB11(IO_L7P_T1_13)
FMC.LA_P23: IC4.AA10(IO_L9P_T1_DQS_13)
FMC.LA_P24: IC4.W15(IO_L16P_T2_13)
FMC.LA_P25: IC4.Y11(IO_L11P_T1_SRCC_13)
FMC.LA_P26: IC4.Y13(IO_L5P_T0_13)
FMC.LA_P27: IC4.AA13(IO_L3P_T0_DQS_13)
FMC.LA_P28: IC4.AA15(IO_L4P_T0_13)
FMC.LA_P29: IC4.Y16(IO_L1P_T0_13)
FMC.LA_P30: IC4.T16(IO_L17P_T2_13)
FMC.LA_P31: IC4.W14(IO_L6P_T0_13)
FMC.LA_P32: IC4.AB16(IO_L2P_T0_13)
FMC.LA_P33: IC4.T14(IO_L15P_T2_DQS_13)
FMC_CLK.CLK_M2C_N0: IC4.C19(IO_L13N_T2_MRCC_16) R24.2
FMC_CLK.CLK_M2C_N1: IC4.C17(IO_L12N_T1_MRCC_16) R25.2
FMC_CLK.CLK_M2C_P0: IC4.C18(IO_L13P_T2_MRCC_16) R24.1
FMC_CLK.CLK_M2C_P1: IC4.D17(IO_L12P_T1_MRCC_16) R25.1
GTP2_SEL: IC4.T3(IO_0_34) ; port GTP2_SEL
GTP3_SEL: IC4.F4(IO_0_35) ; port GTP3_SEL
SHARED_BUS_0: IC6.5(B1)
SHARED_BUS_1: IC5.5(B1)
SHARED_BUS_2: IC6.4(B2)
SHARED_BUS_3: IC7.5(B1)
SHARED_BUS_4: IC5.4(B2)
SHARED_BUS_DIR_0: IC4.F21(IO_25_16) IC6.10(DIR1)
SHARED_BUS_DIR_1: IC4.D20(IO_L19P_T3_16) IC5.10(DIR1)
SHARED_BUS_DIR_2: IC4.E22(IO_L22P_T3_16) IC6.1(DIR2)
SHARED_BUS_DIR_3: IC4.F15(IO_0_16) IC7.10(DIR1)
SHARED_BUS_DIR_4: IC4.D21(IO_L23N_T3_16) IC5.1(DIR2)
SHARED_BUS_VADJ_0: IC4.G22(IO_L24N_T3_16) IC6.8(A1)
SHARED_BUS_VADJ_1: IC4.E21(IO_L23P_T3_16) IC5.8(A1)
SHARED_BUS_VADJ_2: IC4.G21(IO_L24P_T3_16) IC6.9(A2)
SHARED_BUS_VADJ_3: IC4.D14(IO_L6P_T0_16) IC7.8(A1)
SHARED_BUS_VADJ_4: IC4.D22(IO_L22N_T3_16) IC5.9(A2)

Not connected (* = marked no-connect by the designer): IC4 L6(IO_25_35)* U7(IO_25_34)* V7(IO_L19P_T3_34)* Y17(IO_0_13)

### Buses and harness runs
bus FMC.HA_N[0..23]
bus FMC.HA_P[0..23]
bus FMC.HB_N[0..21]
bus FMC.HB_P[0..21]
bus FMC.LA_N[0..33]
bus FMC.LA_P[0..33]
bus FMC_CLK.CLK_M2C_N[0..1]
bus FMC_CLK.CLK_M2C_P[0..1]
bus SHARED_BUS_[0..4] = port SHARED_BUS_[0..4]
harness FMC = port FMC
harness FMC_CLK = port FMC_CLK

### Layout directives
differential pair; differential pair class FMC_LA; differential pair class Diff_100Ohm: (no net found under the mark)
differential pair; differential pair class FMC_HA; differential pair class Diff_100Ohm: (no net found under the mark)
differential pair; differential pair class FMC_HB; differential pair class Diff_100Ohm: (no net found under the mark)
net class FMC_CLK: FMC_CLK.CLK_M2C_N[0..1], FMC_CLK.CLK_M2C_P[0..1]
rule Matched Net Lengths [Delay Tolerance = 11ps]: FMC_CLK.CLK_M2C_N[0..1], FMC_CLK.CLK_M2C_P[0..1]
differential pair; differential pair class Diff_100Ohm: FMC_CLK.CLK_M2C_N[0..1], FMC_CLK.CLK_M2C_P[0..1]

### Notes on the sheet
- (near R25) External termination, do not enable DIFF_TERM.
- FMC MGT[0..3]
- FMC
- FMC, FMC CLK[0..1]
- SDRAM
- EEM, CONF, FMC CLK[2..3]
- Project/Equipment
- Document
- Designer
- Drawn by
- Check.by
- Copyright WUT =CopyrightYear .
  This document describes Open Hardware and is licensed under the CERN-OHL-W v2
  You may redistribute and modify this documentation and make products using it under the terms of the CERN-OHL-W v2 (https:/cern.ch/cern-ohl). This documentation is distributed WITHOUT ANY EXPRESS OR IMPLIED WARRANTY, INCLUDING OF MERCHANTABILITY, SATISFACTORY QUALITY AND FITNESS FOR A PARTICULAR PURPOSE. Please see the CERN-OHL-W v2 for applicable conditions.
  Source location: https://github.com/sinara-hw/EEM_FMC_Carrier
  As per CERN-OHL-W v2 section 4, should You produce hardware based on these sources, You must maintain the Source Location visible on the silkscreen or top copper for a EEM FMC Carrier PCB or other product you make using this documentation.
- Contact:
- File
- Last Mod.
- Print Date
- Sheet
- Size
- A3
- of
- Rev
- (in symbol XC7A200T-3FBG484E, part A) BANK 13
- (in symbol XC7A200T-3FBG484E, part D) BANK 16
- (in symbol XC7A200T-3FBG484E, part E) BANK 34
- (in symbol XC7A200T-3FBG484E, part F) BANK 35

### Library data of the parts
C41 C45 C64#1 C65#1 = CC0201_100NF_6.3V_10%_X5R: Non-polarised capacitor; Part Description: SMD Multilayer Chip Ceramic Capacitor; Manufacturer: GENERIC; Manufacturer1 Part Number: 02016D104KAT2A; Voltage: 6.3V; TC: X5R; Tolerance: ±10%; Table: Capacitors SMD; Part Number: CC0201_100NF_6.3V_10%_X5R; Component Kind: Standard; Component Type: Standard; Pin Count: 2; Value: 100nF; Status: Not Recommended; Manufacturer Part Number: CC0201_100NF_6.3V_10%_X5R; Case: 0201; Mounted: Yes; Socket: No; SMD: Yes; Manufacturer1 Example: AVX; Manufacturer1 ComponentHeight: 0.33mm; HelpURL: \\cern.ch\dfs\Applications\Altium\Datasheets\CC0201_X5R_AVX.pdf; Author: CERN DEM JLC; CreateDate: 2007-12-03; LatestRevisionDate: 2007-12-03
C46-C51 = CC0201_100NF_6.3V_10%_X5R: as C33-C36 on sheet CLK_Distribution; Part Number: CC0201_100NF_6.3V_10%_X5R; Component Kind: Standard; Component Type: Standard; Pin Count: 2; Value: 100nF; Status: Not Recommended; Manufacturer Part Number: CC0201_100NF_6.3V_10%_X5R; Case: 0201; Mounted: Yes; Socket: No; SMD: Yes; Sense: No; Manufacturer1 Example: AVX; Manufacturer1 ComponentHeight: 0.33mm; HelpURL: \\cern.ch\dfs\Applications\Altium\Datasheets\CC0201_X5R_AVX.pdf; Author: CERN DEM JLC; CreateDate: 2007-12-03; LatestRevisionDate: 2007-12-03
IC4 = XC7A200T-3FBG484E: Artix-7 FPGA, 285 User I/Os, 4 GTP, 484-Ball BGA, Pb-Free; Manufacturer Part Number: XC7A200T-3FBG484E; Device: XC7A200T-3FBG484E
IC5-IC7 = SN74AVC2T245RSWR: Dual-Bit Dual-Supply Bus Transceiver With Configurable Voltage Translation and 3-State Outputs; Manufacturer: TEXAS INSTRUMENTS; PressFit: No; Bonding: No; Part Number: SN74AVC2T245RSWR; Component Kind: Standard; Component Type: Standard; Device: SN74AVC2T245RSWR; PackageDescription: QFN, 0.40mm Pitch, Rect.;10 Pin, 1.80mm L X 1.40mm W X 0.55mm H Body, IPC Medium Density; Status: Not Recommended; Part Description: Dual-Bit Dual-Supply Bus Transceiver With Configurable Voltage Translation and 3-State Outputs; Manufacturer Part Number: SN74AVC2T245RSWR; Pin Count: 10; Case: QFN10; Mounted: Yes; Socket: No; SMD: Yes; Sense: No; ComponentHeight: 0.55mm; Author: CERN DEM JLC; HelpURL: \\cern.ch\dfs\Applications\Altium\Datasheets\SN74AVC2T245RSWR.pdf; CreateDate: 07.07.2014; LatestRevisionDate: 30.03.2017
R17 = R0402_10K_1%_0.0625W_100PPM: as R22 on sheet CLK_Distribution; Part Number: R0402_10K_1%_0.0625W_100PPM; Component Kind: Standard; Component Type: Standard; Pin Count: 2; Value: 10k; Status: Not Recommended; Power: 0.0625W; Manufacturer Part Number: R0402_10K_1%_0.0625W_100PPM; Case: 0402; Mounted: Yes; Sense: No; Socket: No; SMD: Yes; Manufacturer1 Example: YAGEO PHYCOMP; Manufacturer1 ComponentHeight: 0.4mm; HelpURL: \\cern.ch\dfs\Applications\Altium\Datasheets\R0402_Phycomp_RC0402.pdf; Author: CERN DEM JLC; CreateDate: 2007-12-03; LatestRevisionDate: 2012-10-17
R24 R25 = R0201_100R_1%_0.05W_200PPM: Resistor - 1%; Part Description: Thick Film Chip Resistor; Manufacturer: GENERIC; Manufacturer1 Part Number: CRCW0201100RFNED; Power: 0.05W; TC: ±200ppm/°C; PressFit: No; Part Number: R0201_100R_1%_0.05W_200PPM; Component Kind: Standard; Component Type: Standard; Pin Count: 2; Value: 100; Status: Not Recommended; Manufacturer Part Number: R0201_100R_1%_0.05W_200PPM; Case: 0201; Mounted: Yes; Sense: No; Socket: No; SMD: Yes; Manufacturer1 Example: VISHAY; Manufacturer1 ComponentHeight: 0.27mm; HelpURL: \\cern.ch\dfs\Applications\Altium\Datasheets\R0201_VISHAY_CRCW e3.pdf; Author: CERN DEM JLC; CreateDate: 2014-11-13; LatestRevisionDate: 2014-11-13
SW2 = SW_OMRON_B3U-3000PM: 1 Ways SPST DIP Switch; Part Description: Ultra-small Surface-mounting Tactile Switche with High Contact Reliability, Side-actuated, Contact Rating 50mA 12VDC; Manufacturer: OMRON; PressFit: No; Sense Comment: Non-washable; Part Number: SW_OMRON_B3U-3000PM; Component Kind: Standard; Component Type: Standard; Pin Count: 2; PackageDescription: Body 3.2x4.0mm, SPST Surface-Mounting Tactile Switch with Side Actuator (B3U Series); Family: Switch; Mounted: Yes; Socket: No; SMD: Yes; Sense: Yes; Status: None; Manufacturer Part Number: B3U-3000PM; ComponentHeight: 1.35mm; HelpURL: \\cern.ch\dfs\Applications\Altium\Datasheets\SW_OMRON_B3U.pdf; Author: CERN DEM HF; CreateDate: 2022-10-04; LatestRevisionDate: 2022-10-04